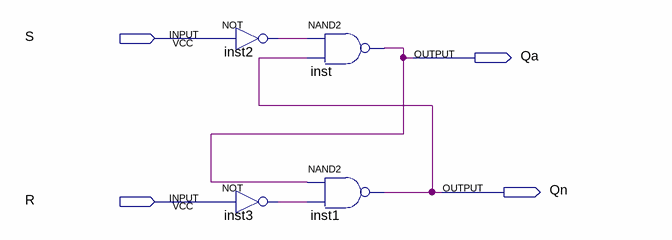
[diagram p0: schematic sheet]
// Quartus schematic lab9step1b.bdf as structural Verilog: 4 symbols, 4 pins
module lab9step1b (
  input  S,
  input  R,
  output Qa,
  output Qn
);

  wire inst2_out, inst3_out;

  not inst2 (inst2_out, S);
  not inst3 (inst3_out, R);
  nand inst (Qa, inst2_out, Qn);
  nand inst1 (Qn, Qa, inst3_out);
endmodule
